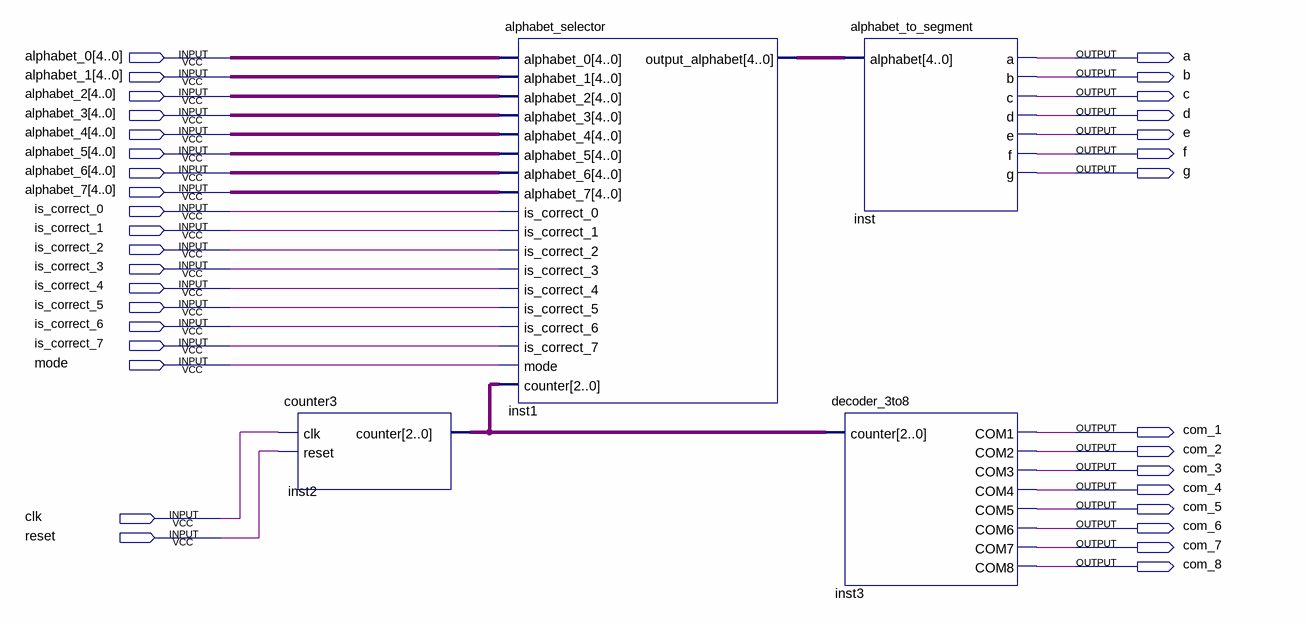
[diagram p0: schematic sheet]
// Quartus schematic array_segment_controller.bdf as structural Verilog: 4 symbols, 34 pins
module array_segment_controller (
  input  [4:0] alphabet_0,
  input  [4:0] alphabet_1,
  input  [4:0] alphabet_2,
  input  [4:0] alphabet_3,
  input  [4:0] alphabet_4,
  input  [4:0] alphabet_5,
  input  [4:0] alphabet_6,
  input  [4:0] alphabet_7,
  input  is_correct_0,
  input  is_correct_1,
  input  is_correct_2,
  input  is_correct_3,
  input  is_correct_4,
  input  is_correct_5,
  input  is_correct_6,
  input  is_correct_7,
  input  mode,
  input  clk,
  input  reset,
  output a,
  output b,
  output c,
  output d,
  output e,
  output f,
  output g,
  output com_1,
  output com_2,
  output com_3,
  output com_4,
  output com_5,
  output com_6,
  output com_7,
  output com_8
);

  wire [2:0] inst2_counter;
  wire [4:0] inst1_output_alphabet;

  counter3 inst2 (.clk(clk), .reset(reset), .counter(inst2_counter));
  alphabet_selector inst1 (
    .alphabet_0(alphabet_0), .alphabet_1(alphabet_1), .alphabet_2(alphabet_2), .alphabet_3(alphabet_3),
    .alphabet_4(alphabet_4), .alphabet_5(alphabet_5), .alphabet_6(alphabet_6), .alphabet_7(alphabet_7),
    .is_correct_0(is_correct_0), .is_correct_1(is_correct_1), .is_correct_2(is_correct_2),
    .is_correct_3(is_correct_3), .is_correct_4(is_correct_4), .is_correct_5(is_correct_5),
    .is_correct_6(is_correct_6), .is_correct_7(is_correct_7), .mode(mode), .counter(inst2_counter),
    .output_alphabet(inst1_output_alphabet));
  alphabet_to_segment inst (.alphabet(inst1_output_alphabet), .a(a), .b(b), .c(c), .d(d), .e(e), .f(f), .g(g));
  decoder_3to8 inst3 (
    .counter(inst2_counter), .COM1(com_1), .COM2(com_2), .COM3(com_3), .COM4(com_4), .COM5(com_5),
    .COM6(com_6), .COM7(com_7), .COM8(com_8));
endmodule
